# EAGLE design RAT_breakout020820 (EAGLE 9.3.0)
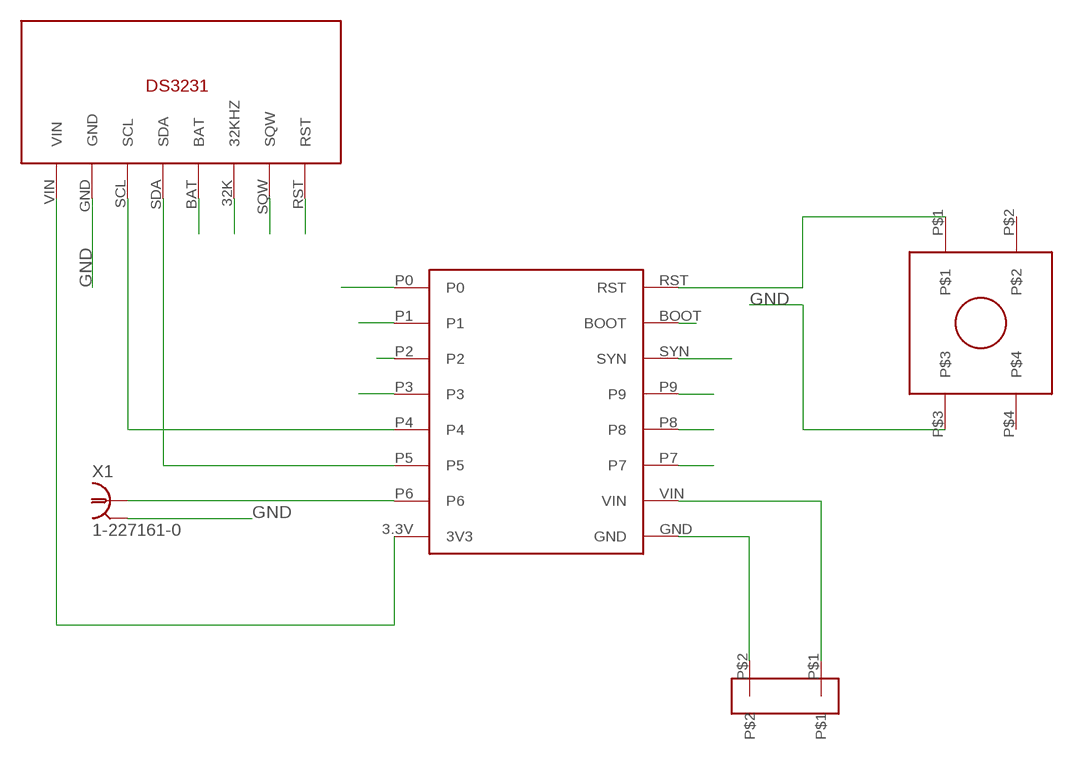
[diagram p0: schematic, sheet 1]

## Parts
U$1  OPENMV_M7  [OPENMV_M7]
U$2  JST_RA_PRT-09749  [JST_RA_PRT-09749]
U$3  BTN_COM-10302  [BTN_COM-10302]
U$6  DS3231-RTC  [DS3231-RTC]
X1  1-227161-0  [AMP_227161]

## Nets
GND: U$1.GND U$2.P$2 U$3.P$3 U$6.GND X1.2
N$1: U$1.RST U$3.P$1
N$2: U$1.VIN U$2.P$1
N$3: U$1.P6 X1.1
N$4: U$1.3.3V(3V3) U$6.VIN
N$5: U$1.P4 U$6.SCL
N$6: U$1.P5 U$6.SDA
N$7: U$1.P8
N$8: U$1.P7
N$18: U$6.BAT
N$19: U$6.32K(32KHZ)
N$20: U$6.SQW
N$21: U$6.RST
N$22: U$1.P0
N$23: U$1.P1
N$24: U$1.P2
N$25: U$1.P3
N$26: U$1.BOOT
N$27: U$1.SYN
N$28: U$1.P9
Unconnected: U$3.P$2 U$3.P$4

## Library data of the parts
U$1 = MIOS:OPENMV_M7
U$2 = MIOS:JST_RA_PRT-09749
U$3 = MIOS:BTN_COM-10302
U$6 = SPIS:DS3231-RTC
X1 = con-coax:?227161*: JACK, RIGHT ANGLE, 50 OHM, PCB, BNC Source: amp_227161.pdf; MF: TYCO ELECTRONICS; MPN: 1-227161; OC_FARNELL: unknown; OC_NEWARK: 33B3200

## Board
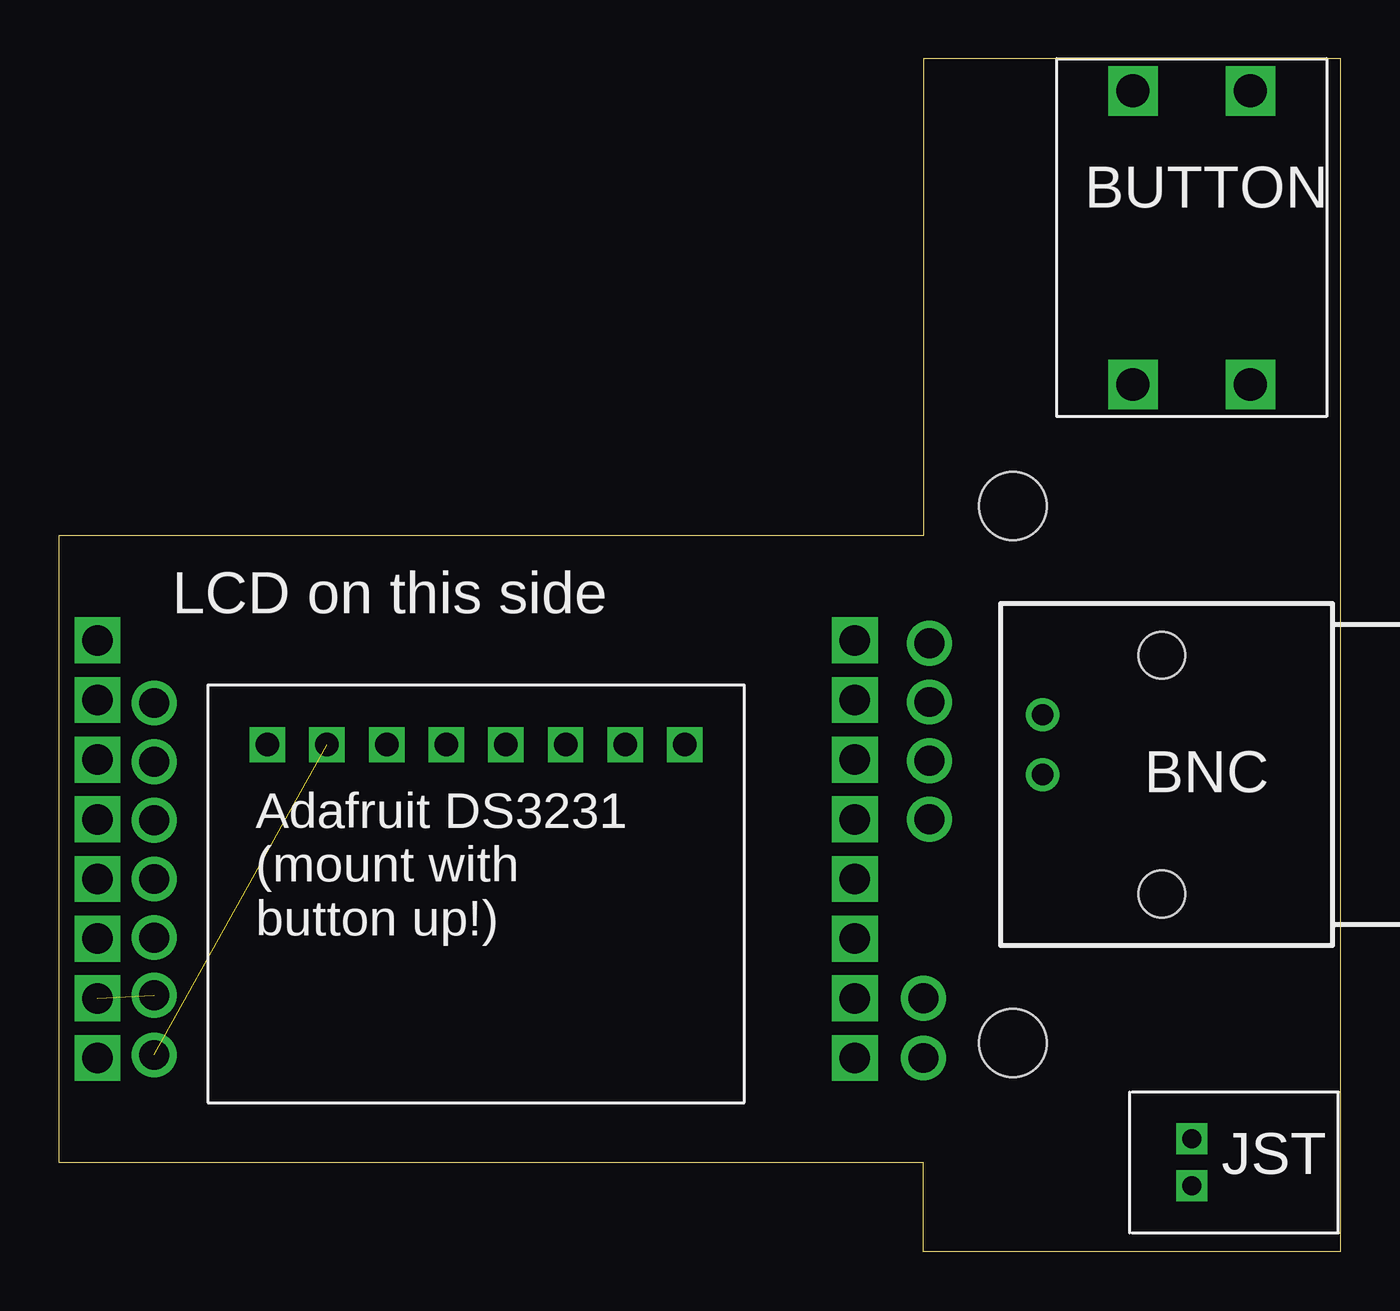
[diagram p1: board, top side]
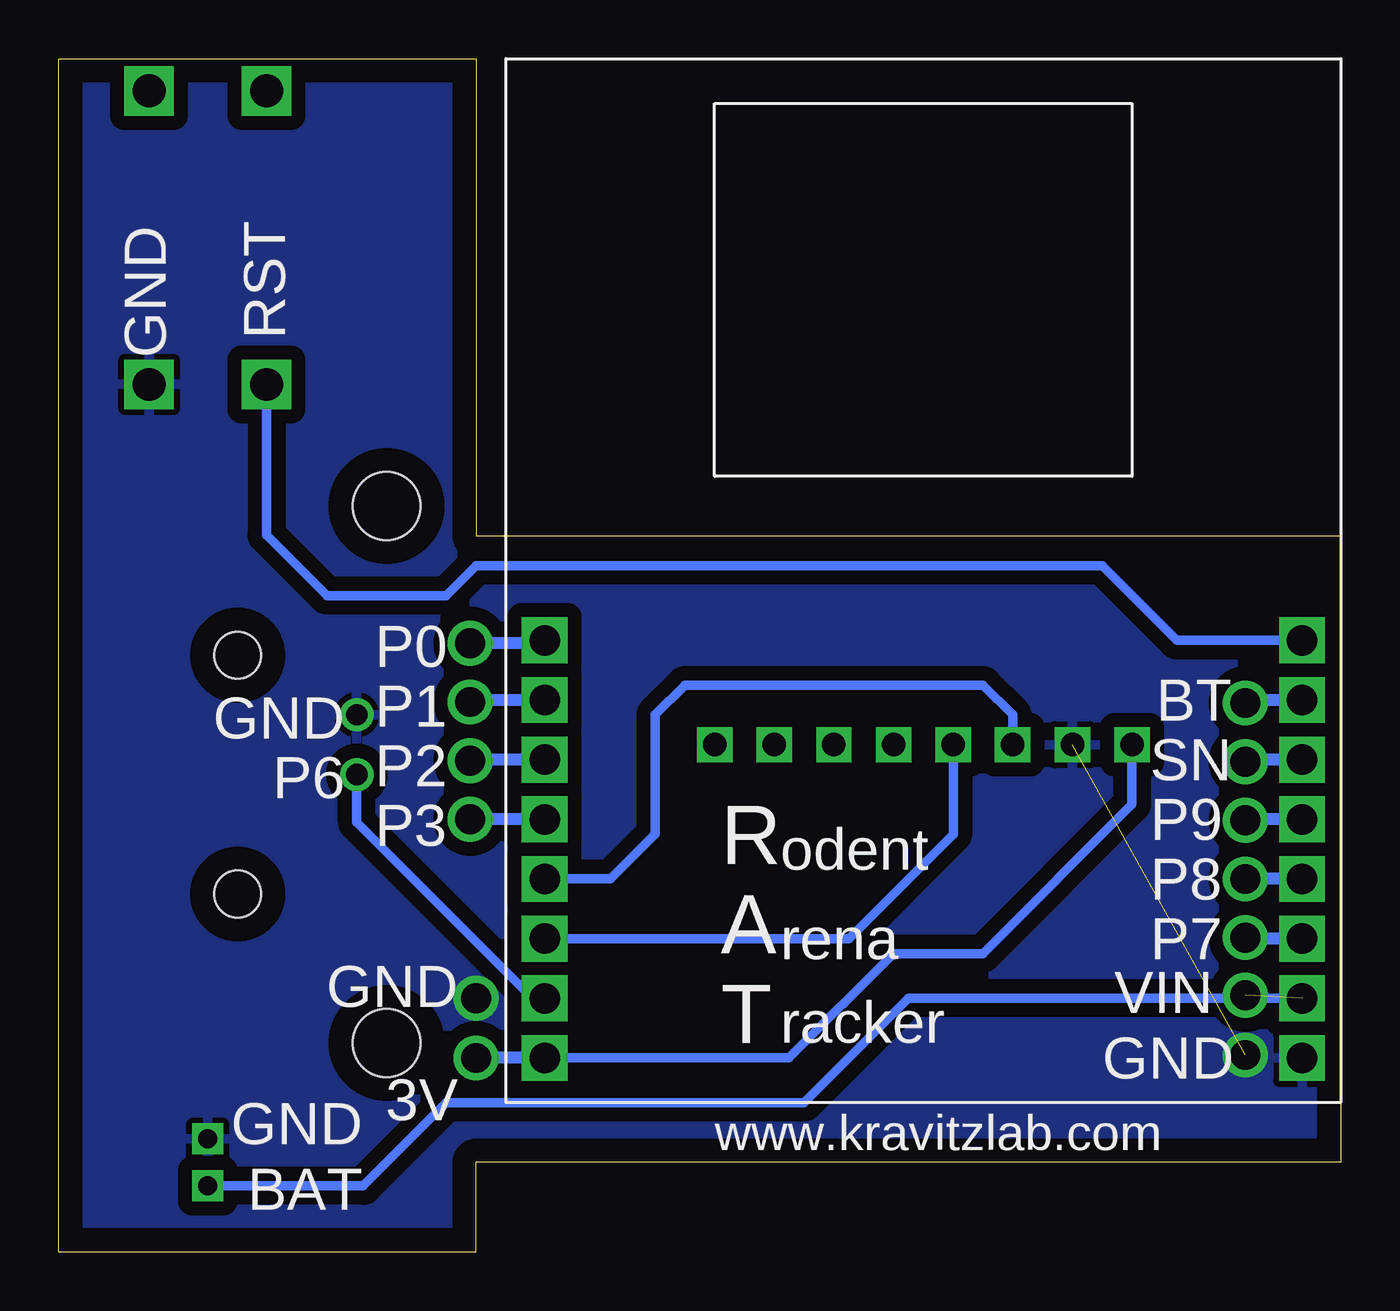
[diagram p2: board, bottom side, seen from below]

Size 54.61 x 50.8 mm. Coordinates in mm from the lower left corner, seen from the top.
Outline: 0,3.81 36.83,3.81 36.83,0 54.61,0 54.61,50.8 36.83,50.8 36.83,30.48 0,30.48 0,3.81
Copper layers (1*16): Top 0.035mm / dielectric 1.5mm / Bottom 0.035mm
Design rules "default": minimum track width 10mil, minimum drill 24mil, track to track 8mil, track to pad 8mil, pad to pad 8mil, via to via 8mil, smd to smd 8mil, copper to edge 40mil, drill to drill 8mil, minimum pad ring 10mil, minimum via ring 8mil, stop-mask expansion 4mil, vias tented up to drill 0mil, thermal gap 10mil

### Footprints (pad centres in the part's own frame; a part is rotated, then mirrored left to right if it is on the bottom)
OPENMV_M7 = drill 1.3 square: 3.3V -16.129,-20.32; BOOT 16.129,-5.08; GND 16.129,-20.32; P0 -16.129,-2.54; P1 -16.129,-5.08; P2 -16.129,-7.62; P3 -16.129,-10.16; P4 -16.129,-12.7; P5 -16.129,-15.24; P6 -16.129,-17.78; P7 16.129,-15.24; P8 16.129,-12.7; P9 16.129,-10.16; RST 16.129,-2.54; SYN 16.129,-7.62; VIN 16.129,-17.78
JST_RA_PRT-09749 = drill 0.8 square: P$1 -1,0; P$2 1,0
BTN_COM-10302 = drill 1.4 square: P$1 -6.25,2.5; P$2 6.25,2.5; P$3 -6.25,-2.5; P$4 6.25,-2.5
4-40_HOLE = hole 2.896: 0,0
DS3231-RTC = drill 1 square: 32K -3.81,0; BAT -1.27,0; GND 6.35,0; RST -8.89,0; SCL 3.81,0; SDA 1.27,0; SQW -6.35,0; VIN 8.89,0
AMP_227161 = drill 0.9 pad 1.27: 1 0,-5.08; 2 -2.54,-5.08 | hole 2: -5.08,0; 5.08,0

### Placement (x,y rotation side)
U$1  17.78,28.58 0 bottom
U$2  48.26,3.81 90 top
U$3  48.26,43.18 90 top
U$4  [4-40_HOLE]  40.64,8.89 0 top
U$5  [4-40_HOLE]  40.64,31.75 0 top
U$6  17.78,21.59 180 top
X1  46.99,20.32 270 top

### Tracks (layer width: path | path; a pad name or v marks a point on that pad's centre or on a via)
GND  (via drill 1.27)  (1 unrouted)
  other vias: 4.06,8.38 36.83,10.79
  pour Bottom (isolate 0.61): 0,30.48 36.83,30.48 36.83,50.8 54.61,50.8 54.61,0 36.83,0 36.83,3.81 0,3.81
N$1
  Bottom 0.406: U$3.P$1 45.76,30.52 43.18,27.94 38.1,27.94 36.83,29.21 10.16,29.21 6.99,26.03 U$1.RST
N$2  (via drill 1.27)  (1 unrouted)
  Bottom 0.406: U$1.VIN 18.41,10.79 22.86,6.35 38.1,6.35 41.64,2.81 U$2.P$1
  other vias: 4.06,10.92
N$3
  Bottom 0.406: U$1.P6 34.42,10.79 41.91,18.29 X1.1
N$4  (via drill 1.27)
  Bottom 0.406: U$6.VIN 8.89,19.05 15.24,12.7 19.05,12.7 23.5,8.25 U$1.3.3V
  Bottom 0.508: U$1.3.3V v36.83,8.25 | v36.83,8.25
N$5
  Bottom 0.406: U$6.SCL 13.97,22.86 15.24,24.13 27.94,24.13 29.21,22.86 29.21,17.78 31.11,15.88 U$1.P4
N$6
  Bottom 0.406: U$6.SDA 16.51,17.78 20.95,13.34 U$1.P5
N$7  (via drill 1.27)
  Bottom 0.508: U$1.P8 v4.06,15.88 | v4.06,15.88
N$8  (via drill 1.27)
  Bottom 0.508: U$1.P7 4.02,13.34 v4.06,13.38
N$22  (via drill 1.27)
  Bottom 0.508: U$1.P0 34.04,25.91 v37.08,25.91
N$23  (via drill 1.27)
  Bottom 0.508: U$1.P1 37,23.49 v37.08,23.41
N$24  (via drill 1.27)
  Bottom 0.508: U$1.P2 37.04,20.95 v37.08,20.91
N$25  (via drill 1.27)
  Bottom 0.508: U$1.P3 v37.08,18.41 | v37.08,18.41
N$26  (via drill 1.27)
  Bottom 0.508: U$1.BOOT 3.94,23.49 v4.06,23.37
N$27  (via drill 1.27)
  Bottom 0.508: U$1.SYN 3.98,20.95 v4.06,20.87
N$28  (via drill 1.27)
  Bottom 0.508: U$1.P9 4.02,18.41 v4.06,18.37

### Text on the board
tNames: BUTTON | LCD on this side | BNC | Adafruit DS3231 / (mount with / button up!) | JST
bNames: GND | RST | P0 | GND | BT | P1 | P6 | SN | P2 | P9 | P3 | odent | P8 | P7 | rena | GND | VIN | racker | R / A / T | GND | 3V | GND | www.kravitzlab.com | BAT